# Altium schematic sheet 555 Astable Multivibrator.schdoc: 555 Astable Multivibrator
size A4; Organization: Altium Limited; Address1: L3, 12a Rodborough Rd; Address2: Frenchs Forest; Address3: NSW; Address4: Australia 2086; DocumentNumber: 1; SheetNumber: 1; SheetTotal: 1
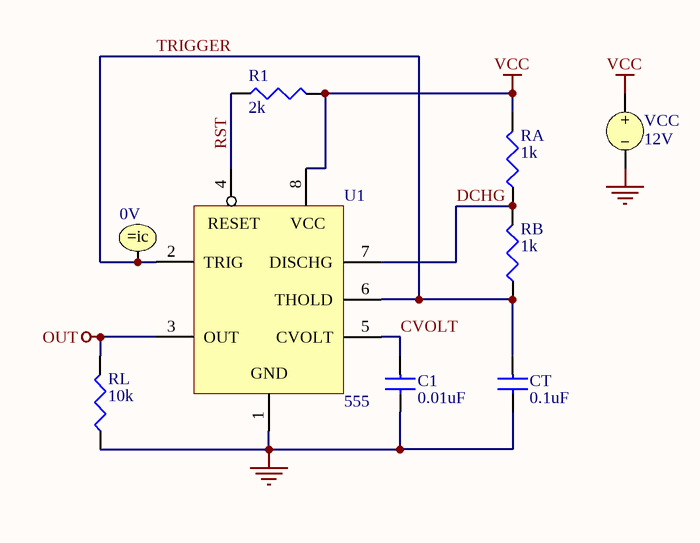
[diagram p0: 555 Astable Multivibrator.schdoc]

## Parts
C1  0.01uF
CT  0.1uF
IC1  0V
R1  2k
RA  1k
RB  1k
RL  10k
U1  555
VCC  12V

## Nets
GND: C1.2 CT.2 RL.2(BOT) U1.1(GND) VCC.2
OUT: RL.1(TOP) U1.3(OUT)
VCC: R1.1(TOP) RA.1(TOP) U1.8(VCC) VCC.1
CVOLT: C1.1 U1.5(CVOLT)
DCHG: RA.2(BOT) RB.1(TOP) U1.7(DISCHG)
RST: R1.2(BOT) U1.4(RESET)
TRIGGER: CT.1 IC1.1 RB.2(BOT) U1.2(TRIG) U1.6(THOLD)

## Notes on the sheet
- Title
- Size:
- Date:
- A4
- Number:
- Time:
- Revision:
- Sheet
- of
- File:

## Library data of the parts
C1 CT = CAP: Capacitor
  C1: Value: 0.01uF
  CT: Value: 0.1uF
IC1 = .IC: Initial Condition; Initial Voltage: 0V
R1 RA RB RL = RES: Resistor
  R1: Value: 2k
  RA RB: Value: 1k
  RL: Value: 10k
U1 = 555: Timer
VCC = VSRC: Voltage Source; Value: 12V